# Altium schematic sheet VNA_4.SchDoc: VNA
size 409 x 289 mm; Origin: Eagle; OriginPath: C:\Users\Ground Lab\Desktop\LibreVNA\Hardware\Eagle\VNA.sch; OriginSheet: 5; OriginDescription: 1. LO; Date: 04.05.2025 20:03:37; SheetNumber: 5; GateName_1: G$1; SymbolName_1: A3L-LOC; LibraryName: VNA; DeviceSetName: A3L-LOC; Sheet: Sheet:
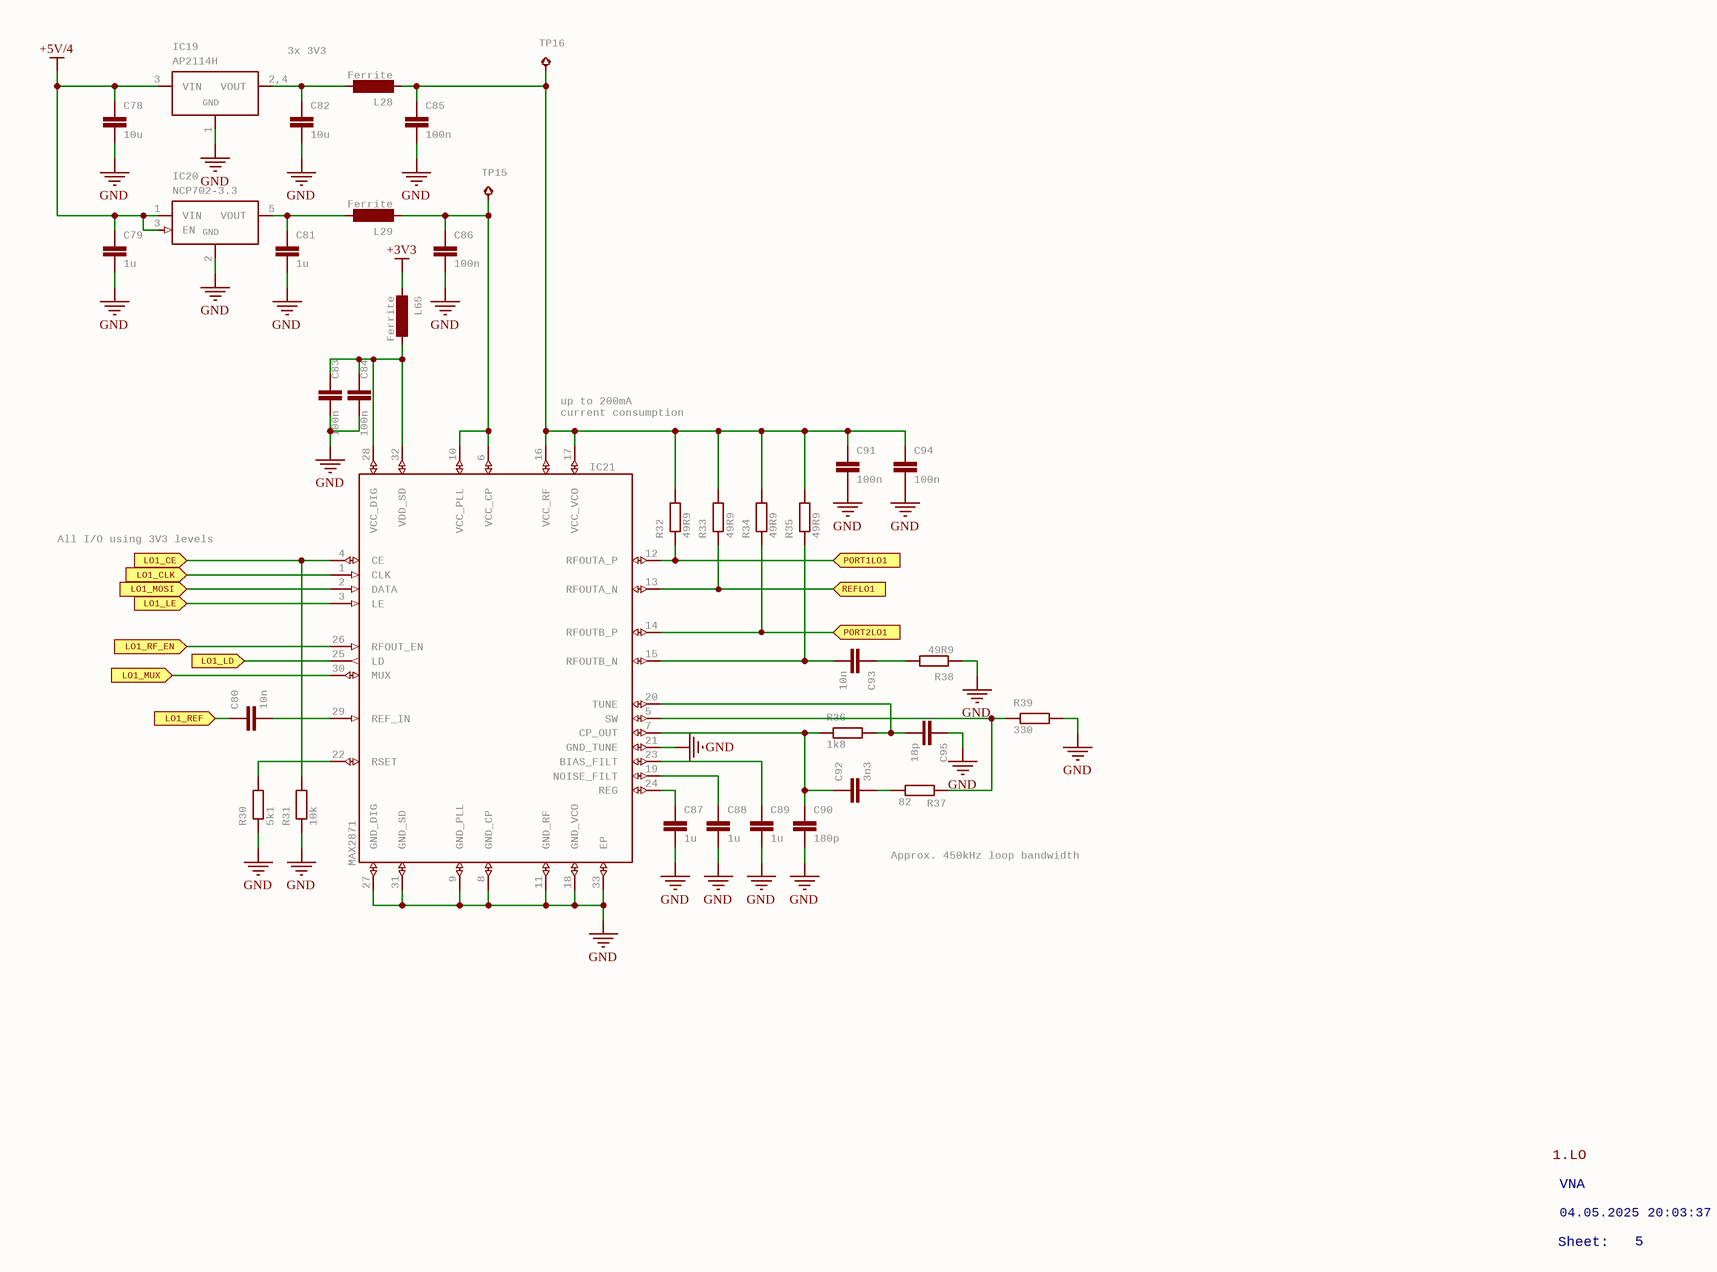
[diagram p0: VNA_4.SchDoc]

## Parts
C78  10u  [C1206]
C79  1u  [C0603]
C80  10n  [C0402]
C81  1u  [C0603]
C82  10u  [C1206]
C83  100n  [C0402]
C84  100n  [C0402]
C85  100n  [C0402]
C86  100n  [C0402]
C87  1u  [C0402]
C88  1u  [C0402]
C89  1u  [C0402]
C90  180p  [C0402]
C91  100n  [C0402]
C92  3n3  [C0402]
C93  10n  [C0402]
C94  100n  [C0402]
C95  18p  [C0402]
IC19  AP2114H  [SOT230P700X180-4]
IC20  NCP702-3.3  [SOT95P240X110-5]
IC21  MAX2871  [QFN50P500X500X80-33T310]
L28  Ferrite  [R0402]
L29  Ferrite  [R0402]
L65  Ferrite  [R0402]
R30  5k1  [R0402]
R31  10k  [R0402]
R32  49R9  [R0402]
R33  49R9  [R0402]
R34  49R9  [R0402]
R35  49R9  [R0402]
R36  1k8  [R0402]
R37  82  [R0402]
R38  49R9  [R0402]
R39  330  [R0402]
TP15  TPB1,27  [B1,27]  (value not drawn)
TP16  TPB1,27  [B1,27]  (value not drawn)

## Ports
LO1_CE (in), LO1_CLK (in), LO1_LD (in), LO1_LE (in), LO1_MOSI (in), LO1_MUX (in), LO1_REF (in), LO1_RF_EN (in), PORT1LO1 (in), PORT2LO1 (in), REFLO1 (in)

## Nets
+3V3: L65.2
+5V/4: C78.1 C79.1 IC19.3(VIN) IC20.1(VIN) IC20.3(EN)
GND: C78.2 C79.2 C81.2 C82.2 C83.2 C84.2 C85.2 C86.2 C87.2 C88.2 C89.2 C90.2 C91.2 C94.2 C95.1 IC19.1(GND) IC20.2(GND) IC21.8(GND_CP) IC21.9(GND_PLL) IC21.11(GND_RF) IC21.18(GND_VCO) IC21.21(GND_TUNE) IC21.27(GND_DIG) IC21.31(GND_SD) IC21.33(EP) R30.1 R31.1 R38.1 R39.2
LO1_CE: C80.2 IC21.4(CE) IC21.29(REF_IN) R31.2 ; port LO1_CE
LO1_CLK: IC21.1(CLK) ; port LO1_CLK
LO1_LD: IC21.25(LD) ; port LO1_LD
LO1_LE: IC21.3(LE) ; port LO1_LE
LO1_MOSI: IC21.2(DATA) ; port LO1_MOSI
LO1_MUX: IC21.30(MUX) ; port LO1_MUX
LO1_REF: C80.1 ; port LO1_REF
LO1_RF_EN: IC21.26(RFOUT_EN) ; port LO1_RF_EN
PORT1LO1: IC21.12(RFOUTA_P) R32.1 ; port PORT1LO1
PORT2LO1: IC21.14(RFOUTB_P) R34.1 ; port PORT2LO1
REFLO1: IC21.13(RFOUTA_N) R33.1 ; port REFLO1
NetC81_1: C81.1 IC20.5(VOUT) L29.1
NetC82_1: C82.1 IC19.2,4(VOUT) L28.1
NetC83_1: C83.1 C84.1 IC21.28(VCC_DIG) IC21.32(VDD_SD) L65.1
NetC85_1: C85.1 C91.1 C94.1 IC21.16(VCC_RF) IC21.17(VCC_VCO) L28.2 R32.2 R33.2 R34.2 R35.2 TP16.TP
NetC86_1: C86.1 IC21.6(VCC_CP) IC21.10(VCC_PLL) L29.2 TP15.TP
NetC87_1: C87.1 IC21.24(REG)
NetC88_1: C88.1 IC21.19(NOISE_FILT)
NetC89_1: C89.1 IC21.23(BIAS_FILT)
NetC90_1: C90.1 C92.1 IC21.7(CP_OUT) R36.1
NetC92_2: C92.2 R37.1
NetC93_1: C93.1 R38.2
NetC93_2: C93.2 IC21.15(RFOUTB_N) R35.1
NetC95_2: C95.2 IC21.20(TUNE) R36.2
NetIC21_5: IC21.5(SW) R37.2 R39.1
NetIC21_22: IC21.22(RSET) R30.2

## Notes on the sheet
- 3x 3V3
- up to 200mA
  current consumption
- All I/O using 3V3 levels
- Approx. 450kHz loop bandwidth
- 1.LO
- VNA
- Sheet:
- 04.05.2025 20:03:37
- 5

## Library data of the parts
C78 C82 = C-EUC1206: CAPACITOR, European symbol; GateName_1: G$1; SymbolName_1: C-EU; DeviceName: C1206; LibraryName: VNA; DeviceSetName: C-EU
C79 C81 = C-EU*?:1C0603: CAPACITOR, European symbol; GateName_1: G$1; SymbolName_1: C-EU-1; DeviceName: C0603; LibraryName: VNA; DeviceSetName: C-EU*?:1
C80 C83-C95 = C-EU*?:2C0402: CAPACITOR, European symbol; GateName_1: G$1; SymbolName_1: C-EU:1; DeviceName: C0402; LibraryName: VNA; DeviceSetName: C-EU*?:2
IC19 = AP2114H: GateName_1: G$1; SymbolName_1: VREG; DeviceName: H; DeviceSetName: AP2114; LibraryName: VNA; GND: GND
IC20 = NCP702: GateName_1: G$1; SymbolName_1: VREG_EN; LibraryName: VNA; DeviceSetName: NCP702; GND: GND
IC21 = MAX2871: GateName_1: G$1; SymbolName_1: MAX2871; LibraryName: VNA; DeviceSetName: MAX2871
L28 L29 L65 = FERRITE: GateName_1: G$1; SymbolName_1: L-EU:1; LibraryName: VNA; DeviceSetName: FERRITE
R30-R39 = R-EU_R0402: RESISTOR, European symbol; GateName_1: G$1; SymbolName_1: R-EU; DeviceSetName: R-EU_; DeviceName: R0402; LibraryName: VNA
TP15 TP16 = TPB1,27: Test pad; GateName_1: G$1; SymbolName_1: TP; DeviceName: B1,27; LibraryName: VNA; DeviceSetName: TP